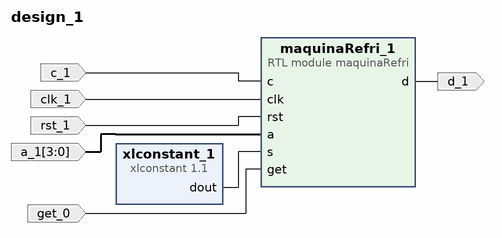
[diagram p0: block diagram of the top level]
# Vivado block design design_1, xc7z010clg400-1, Vivado 2017.4
create_bd_design design_1

create_bd_port -dir O d_1
create_bd_port -dir I c_1
create_bd_port -dir I -type clk clk_1
create_bd_port -dir I -type rst rst_1
create_bd_port -dir I -from 3 -to 0 a_1
create_bd_port -dir I get_0

create_bd_cell -type ip -vlnv xilinx.com:ip:xlconstant:1.1 xlconstant_1
set_property -dict {CONFIG.CONST_WIDTH 4 CONFIG.CONST_VAL 9} [get_bd_cells xlconstant_1]
create_bd_cell -type module -reference maquinaRefri maquinaRefri_1

# ---- connections ----

connect_bd_net [get_bd_pins maquinaRefri_1/d] [get_bd_ports d_1]
connect_bd_net -net c_1_1 [get_bd_ports c_1] [get_bd_pins maquinaRefri_1/c]
connect_bd_net -net clk_1_1 [get_bd_ports clk_1] [get_bd_pins maquinaRefri_1/clk]
connect_bd_net -net rst_1_1 [get_bd_ports rst_1] [get_bd_pins maquinaRefri_1/rst]
connect_bd_net -net a_1_1 [get_bd_ports a_1] [get_bd_pins maquinaRefri_1/a]
connect_bd_net [get_bd_pins xlconstant_1/dout] [get_bd_pins maquinaRefri_1/s]
connect_bd_net -net get_0_1 [get_bd_ports get_0] [get_bd_pins maquinaRefri_1/get]

validate_bd_design
save_bd_design
